# EAGLE design miniplatform (EAGLE 6.5.0)
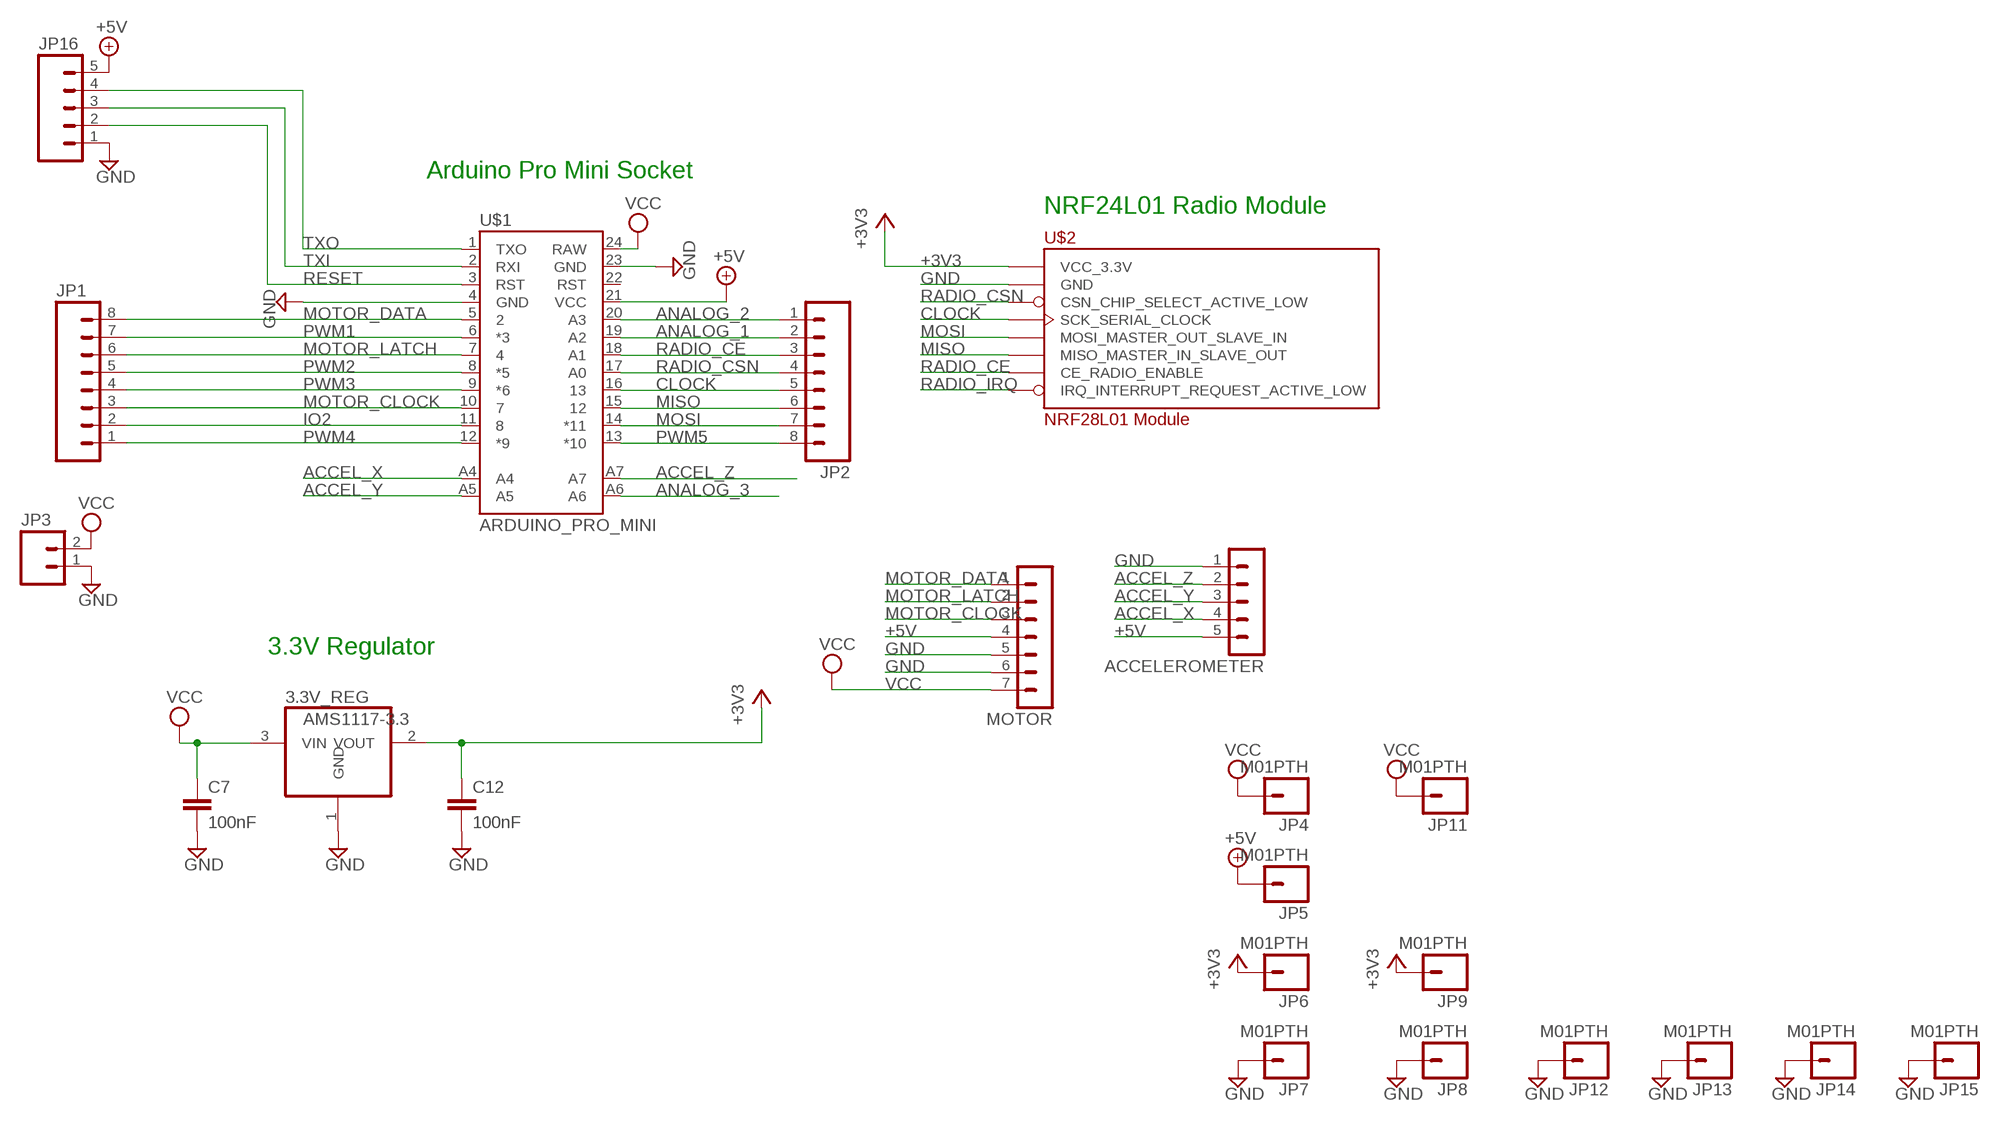
[diagram p0: schematic, sheet 1]

## Parts
3.3V_REG  AMS1117-3.3  REG1117  [SOT223]
ACCELEROMETER  MA05-1  [MA05-1]
C7  100nF  C-EUC0805K  [C0805K]
C12  100nF  C-EUC0805K  [C0805K]
JP1  M081X08  [1X08]
JP2  M081X08  [1X08]
JP3  M02LOCK_LONGPADS  [1X02_LOCK_LONGPADS]
JP4  M01PTH  [1X01]
JP5  M01PTH  [1X01]
JP6  M01PTH  [1X01]
JP7  M01PTH  [1X01]
JP8  M01PTH  [1X01]
JP9  M01PTH  [1X01]
JP11  M01PTH  [1X01]
JP12  M01PTH  [1X01]
JP13  M01PTH  [1X01]
JP14  M01PTH  [1X01]
JP15  M01PTH  [1X01]
JP16  M05PTH  [1X05]
MOTOR  MA07-1  [MA07-1]
U$1  ARDUINO_PRO_MINI  [ARDUINO_PRO_MINI]
U$2  NRF28L01 Module  NRF24L01_MODULE  [NRF24L01_MODULE]

## Nets
+3V3: 3.3V_REG.2(VOUT) C12.1 JP6.1 JP9.1 U$2.P$2(VCC_3.3V)
+5V: 3.3V_REG.3(VIN) ACCELEROMETER.5 C7.1 JP5.1 JP16.5 MOTOR.4 U$1.21(VCC) ; supply symbol labelled VCC
+12V: U$1.24(RAW) ; supply symbol labelled VCC
ACCEL_X: ACCELEROMETER.4 U$1.A4
ACCEL_Y: ACCELEROMETER.3 U$1.A5
ACCEL_Z: ACCELEROMETER.2 U$1.A7
ANALOG_1: JP2.2 U$1.19(A2)
ANALOG_2: JP2.1 U$1.20(A3)
ANALOG_3: U$1.A6
CLOCK: JP2.5 U$1.16 U$2.P$5(SCK_SERIAL_CLOCK)
GND: 3.3V_REG.1(GND) ACCELEROMETER.1 C7.2 C12.2 JP3.1 JP7.1 JP8.1 JP12.1 JP13.1 JP14.1 JP15.1 JP16.1 MOTOR.5 MOTOR.6 U$1.4(GND) U$1.23(GND) U$2.P$1(GND)
IO2: JP1.2 U$1.11
MISO: JP2.6 U$1.15 U$2.P$7(MISO_MASTER_IN_SLAVE_OUT)
MOSI: JP2.7 U$1.14(*11) U$2.P$6(MOSI_MASTER_OUT_SLAVE_IN)
MOTOR_CLOCK: JP1.3 MOTOR.3 U$1.10
MOTOR_DATA: JP1.8 MOTOR.1 U$1.5
MOTOR_LATCH: JP1.6 MOTOR.2 U$1.7
PWM1: JP1.7 U$1.6(*3)
PWM2: JP1.5 U$1.8(*5)
PWM3: JP1.4 U$1.9(*6)
PWM4: JP1.1 U$1.12(*9)
PWM5: JP2.8 U$1.13(*10)
RADIO_CE: JP2.3 U$1.18(A1) U$2.P$3(CE_RADIO_ENABLE)
RADIO_CSN: JP2.4 U$1.17(A0) U$2.P$4(CSN_CHIP_SELECT_ACTIVE_LOW)
RADIO_IRQ: U$2.P$8(IRQ_INTERRUPT_REQUEST_ACTIVE_LOW)
RESET: JP16.2 U$1.3(RST)
TXI: JP16.3 U$1.2(RXI)
TXO: JP16.4 U$1.1(TXO)
VCC: JP3.2 JP4.1 JP11.1 MOTOR.7
Unconnected: U$1.22(RST)

## Notes on the sheet
- Arduino Pro Mini Socket
- NRF24L01 Radio Module
- 3.3V Regulator

## Library data of the parts
3.3V_REG = burr-brown:REG1117: 800mA and 1A Low Dropout (LDO) Positive Regulator 1.8V, 2.5V, 2.85V, 3.3V, 5V, and Adj; MPN: REG1117; OC_FARNELL: 1097566; OC_NEWARK: 14P6981
ACCELEROMETER = con-lstb:MA05-1: PIN HEADER; OC_FARNELL: unknown; OC_NEWARK: unknown
C7 C12 = rcl:C-EU: CAPACITOR, European symbol
JP1 JP2 = SparkFun:M08: Header 8 Standard 8-pin 0.1" header. Use with straight break away headers (SKU : PRT-00116), right angle break away headers (PRT-00553), swiss pins (PRT-00743), machine pins (PRT-00117), and female headers (PRT-00115).
JP3 = SparkFun:M02: Header 2 Standard 2-pin 0.1" header. Use with straight break away headers (SKU : PRT-00116), right angle break away headers (PRT-00553), swiss pins (PRT-00743), machine pins (PRT-00117), and female headers (PRT-00115). Molex polarized connector foot print use with SKU : PRT-08233 with associated crimp pins and housings.
JP4-JP9 JP11-JP15 = SparkFun:M01: Header 1 Standard 1-pin 0.1" header. Use with straight break away headers (SKU : PRT-00116), right angle break away headers (PRT-00553), swiss pins (PRT-00743), machine pins (PRT-00117), and female headers (PRT-00115).
JP16 = SparkFun:M05: Header 5 Standard 5-pin 0.1" header. Use with straight break away headers (SKU : PRT-00116), right angle break away headers (PRT-00553), swiss pins (PRT-00743), machine pins (PRT-00117), and female headers (PRT-00115). Molex polarized connector foot print use with SKU : PRT-08230 with associated crimp pins and housings.
MOTOR = con-lstb:MA07-1: PIN HEADER; OC_FARNELL: unknown; OC_NEWARK: unknown
U$1 = SparkFun-Boards-with-arduino-pro-mini-without-connection-pins:ARDUINO_PRO_MINI
U$2 = common_modules:NRF24L01_MODULE

## Board
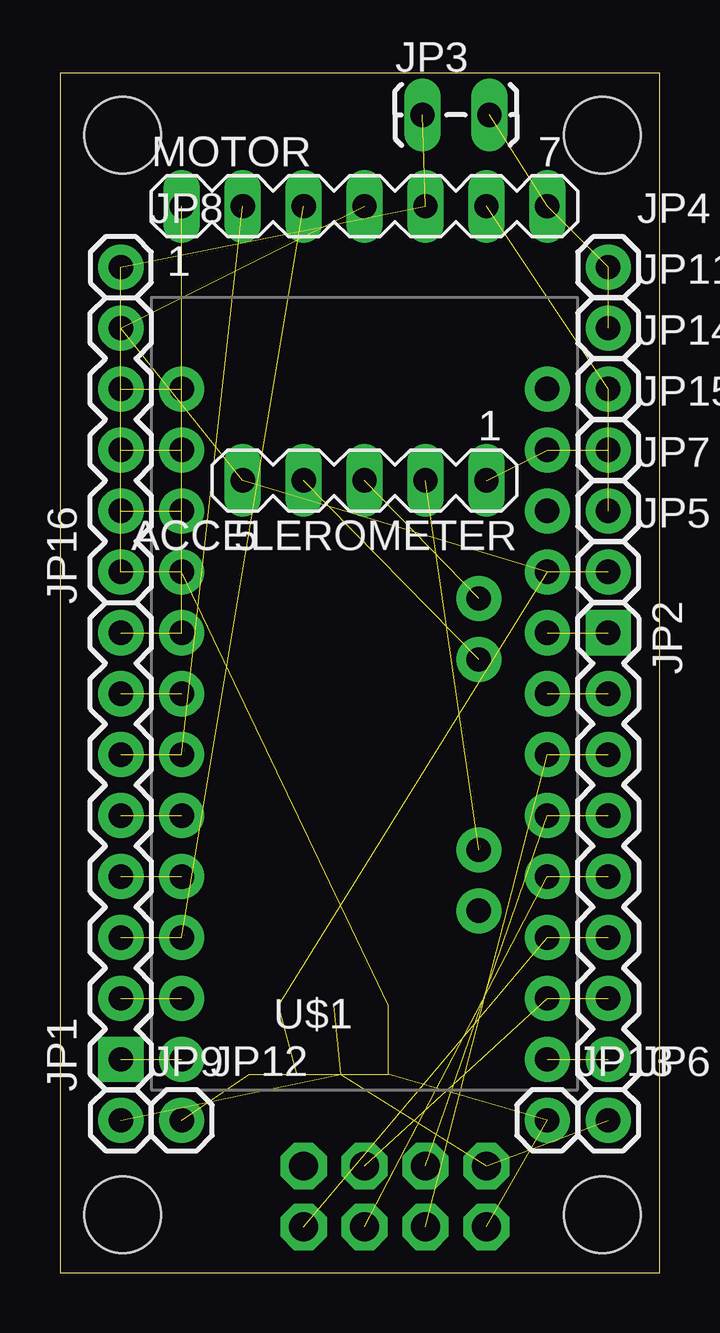
[diagram p1: board, top side]
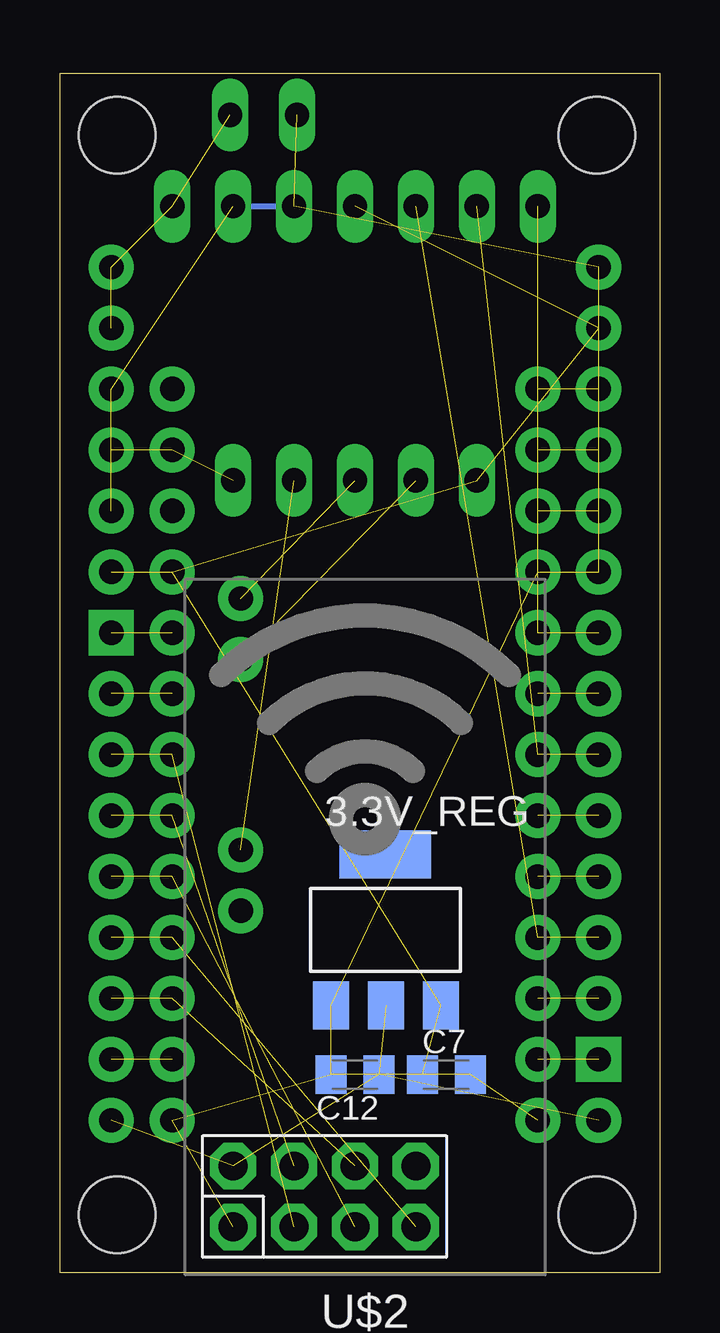
[diagram p2: board, bottom side, seen from below]

Size 25 x 50 mm. Coordinates in mm from the lower left corner, seen from the top.
Outline: 0,0 25,0 25,50 0,50 0,0
Copper layers (1*16): Top 0.035mm / dielectric 1.5mm / Bottom 0.035mm
Design rules "default": minimum track width 10mil, minimum drill 24mil, track to track 8mil, track to pad 8mil, pad to pad 8mil, via to via 8mil, smd to smd 8mil, copper to edge 40mil, drill to drill 8mil, minimum pad ring 10mil, minimum via ring 8mil, stop-mask expansion 4mil, vias tented up to drill 0mil, thermal gap 10mil
Holes 3.2 mm at 22.61,47.41 2.61,47.41 2.61,2.41 22.61,2.41

### Footprints (pad centres in the part's own frame; a part is rotated, then mirrored left to right if it is on the bottom)
SOT223 = smd 1.499 x 2.007: 1 -2.261,-3.15; 2 0.025,-3.15; 3 2.311,-3.15 | smd 3.81 x 2.007: 4 0,3.15
MA05-1 = drill 1.016 long: 1 -5.08,0; 2 -2.54,0; 3 0,0; 4 2.54,0; 5 5.08,0
C0805K = smd 1.3 x 1.6: 1 -1,0; 2 1,0
1X08 = drill 1.016 pad 1.88 square: 1 0,0 | drill 1.016 pad 1.88: 2 2.54,0; 3 5.08,0; 4 7.62,0; 5 10.16,0; 6 12.7,0; 7 15.24,0; 8 17.78,0
1X02_LOCK_LONGPADS = drill 1.016 long: 1 -0.127,0; 2 2.667,0
1X01 = drill 1.016 pad 1.88: 1 0,0
1X05 = drill 1.016 pad 1.88: 1 0,0; 2 2.54,0; 3 5.08,0; 4 7.62,0; 5 10.16,0
MA07-1 = drill 1.016 long: 1 -7.62,0; 2 -5.08,0; 3 -2.54,0; 4 0,0; 5 2.54,0; 6 5.08,0; 7 7.62,0
ARDUINO_PRO_MINI = drill 1.016 pad 1.88: 1 -7.62,12.7; 2 -7.62,10.16; 3 -7.62,7.62; 4 -7.62,5.08; 5 -7.62,2.54; 6 -7.62,0; 7 -7.62,-2.54; 8 -7.62,-5.08; 9 -7.62,-7.62; 10 -7.62,-10.16; 11 -7.62,-12.7; 12 -7.62,-15.24; 13 7.62,-15.24; 14 7.62,-12.7; 15 7.62,-10.16; 16 7.62,-7.62; 17 7.62,-5.08; 18 7.62,-2.54; 19 7.62,0; 20 7.62,2.54; 21 7.62,5.08; 22 7.62,7.62; 23 7.62,10.16; 24 7.62,12.7; A4 4.763,1.429; A5 4.763,3.969; A6 4.763,-9.049; A7 4.763,-6.509
NRF24L01_MODULE = drill 1.2 pad 1.93 octagon: P$1 0,0; P$2 0,2.54; P$3 2.54,0; P$4 2.54,2.54; P$5 5.08,0; P$6 5.08,2.54; P$7 7.62,0; P$8 7.62,2.54

### Placement (x,y rotation side)
3.3V_REG  11.43,14.29 0 bottom
ACCELEROMETER  12.7,33.02 180 top
C7  8.89,8.26 0 bottom
C12  12.7,8.26 180 bottom
JP1  2.54,8.89 90 top
JP2  22.86,26.67 270 top
JP3  15.24,48.26 0 top
JP4  22.86,41.91 0 top
JP5  22.86,29.21 0 top
JP6  22.86,6.35 0 top
JP7  22.86,31.75 0 top
JP8  2.54,41.91 0 top
JP9  2.54,6.35 0 top
JP11  22.86,39.37 0 top
JP12  5.08,6.35 0 top
JP13  20.32,6.35 0 top
JP14  22.86,36.83 0 top
JP15  22.86,34.29 0 top
JP16  2.54,29.21 90 top
MOTOR  12.7,44.45 0 top
U$1  12.7,24.13 0 top
U$2  17.78,1.91 0 bottom

### Tracks (layer width: path | path; a pad name or v marks a point on that pad's centre or on a via)
+3V3  (4 unrouted)
+5V  (6 unrouted)
ACCEL_X  (1 unrouted)
ACCEL_Y  (1 unrouted)
ACCEL_Z  (1 unrouted)
ANALOG_1  (1 unrouted)
ANALOG_2  (1 unrouted)
CLOCK  (2 unrouted)
GND  (15 unrouted)
  Bottom 0.254: MOTOR.6 MOTOR.5
IO2  (1 unrouted)
MISO  (2 unrouted)
MOSI  (2 unrouted)
MOTOR_CLOCK  (2 unrouted)
MOTOR_DATA  (2 unrouted)
MOTOR_LATCH  (2 unrouted)
PWM1  (1 unrouted)
PWM2  (1 unrouted)
PWM3  (1 unrouted)
PWM4  (1 unrouted)
PWM5  (1 unrouted)
RADIO_CE  (2 unrouted)
RADIO_CSN  (2 unrouted)
RESET  (1 unrouted)
TXI  (1 unrouted)
TXO  (1 unrouted)
VCC  (3 unrouted)